# Altium schematic sheet main.SchDoc: =ProjectName+'_'+Revision+'_'+VariantName
size A3; Author: [Sheet Author]; DocumentNumber: 1; Revision: 0; SheetNumber: 1; SheetTotal: 5
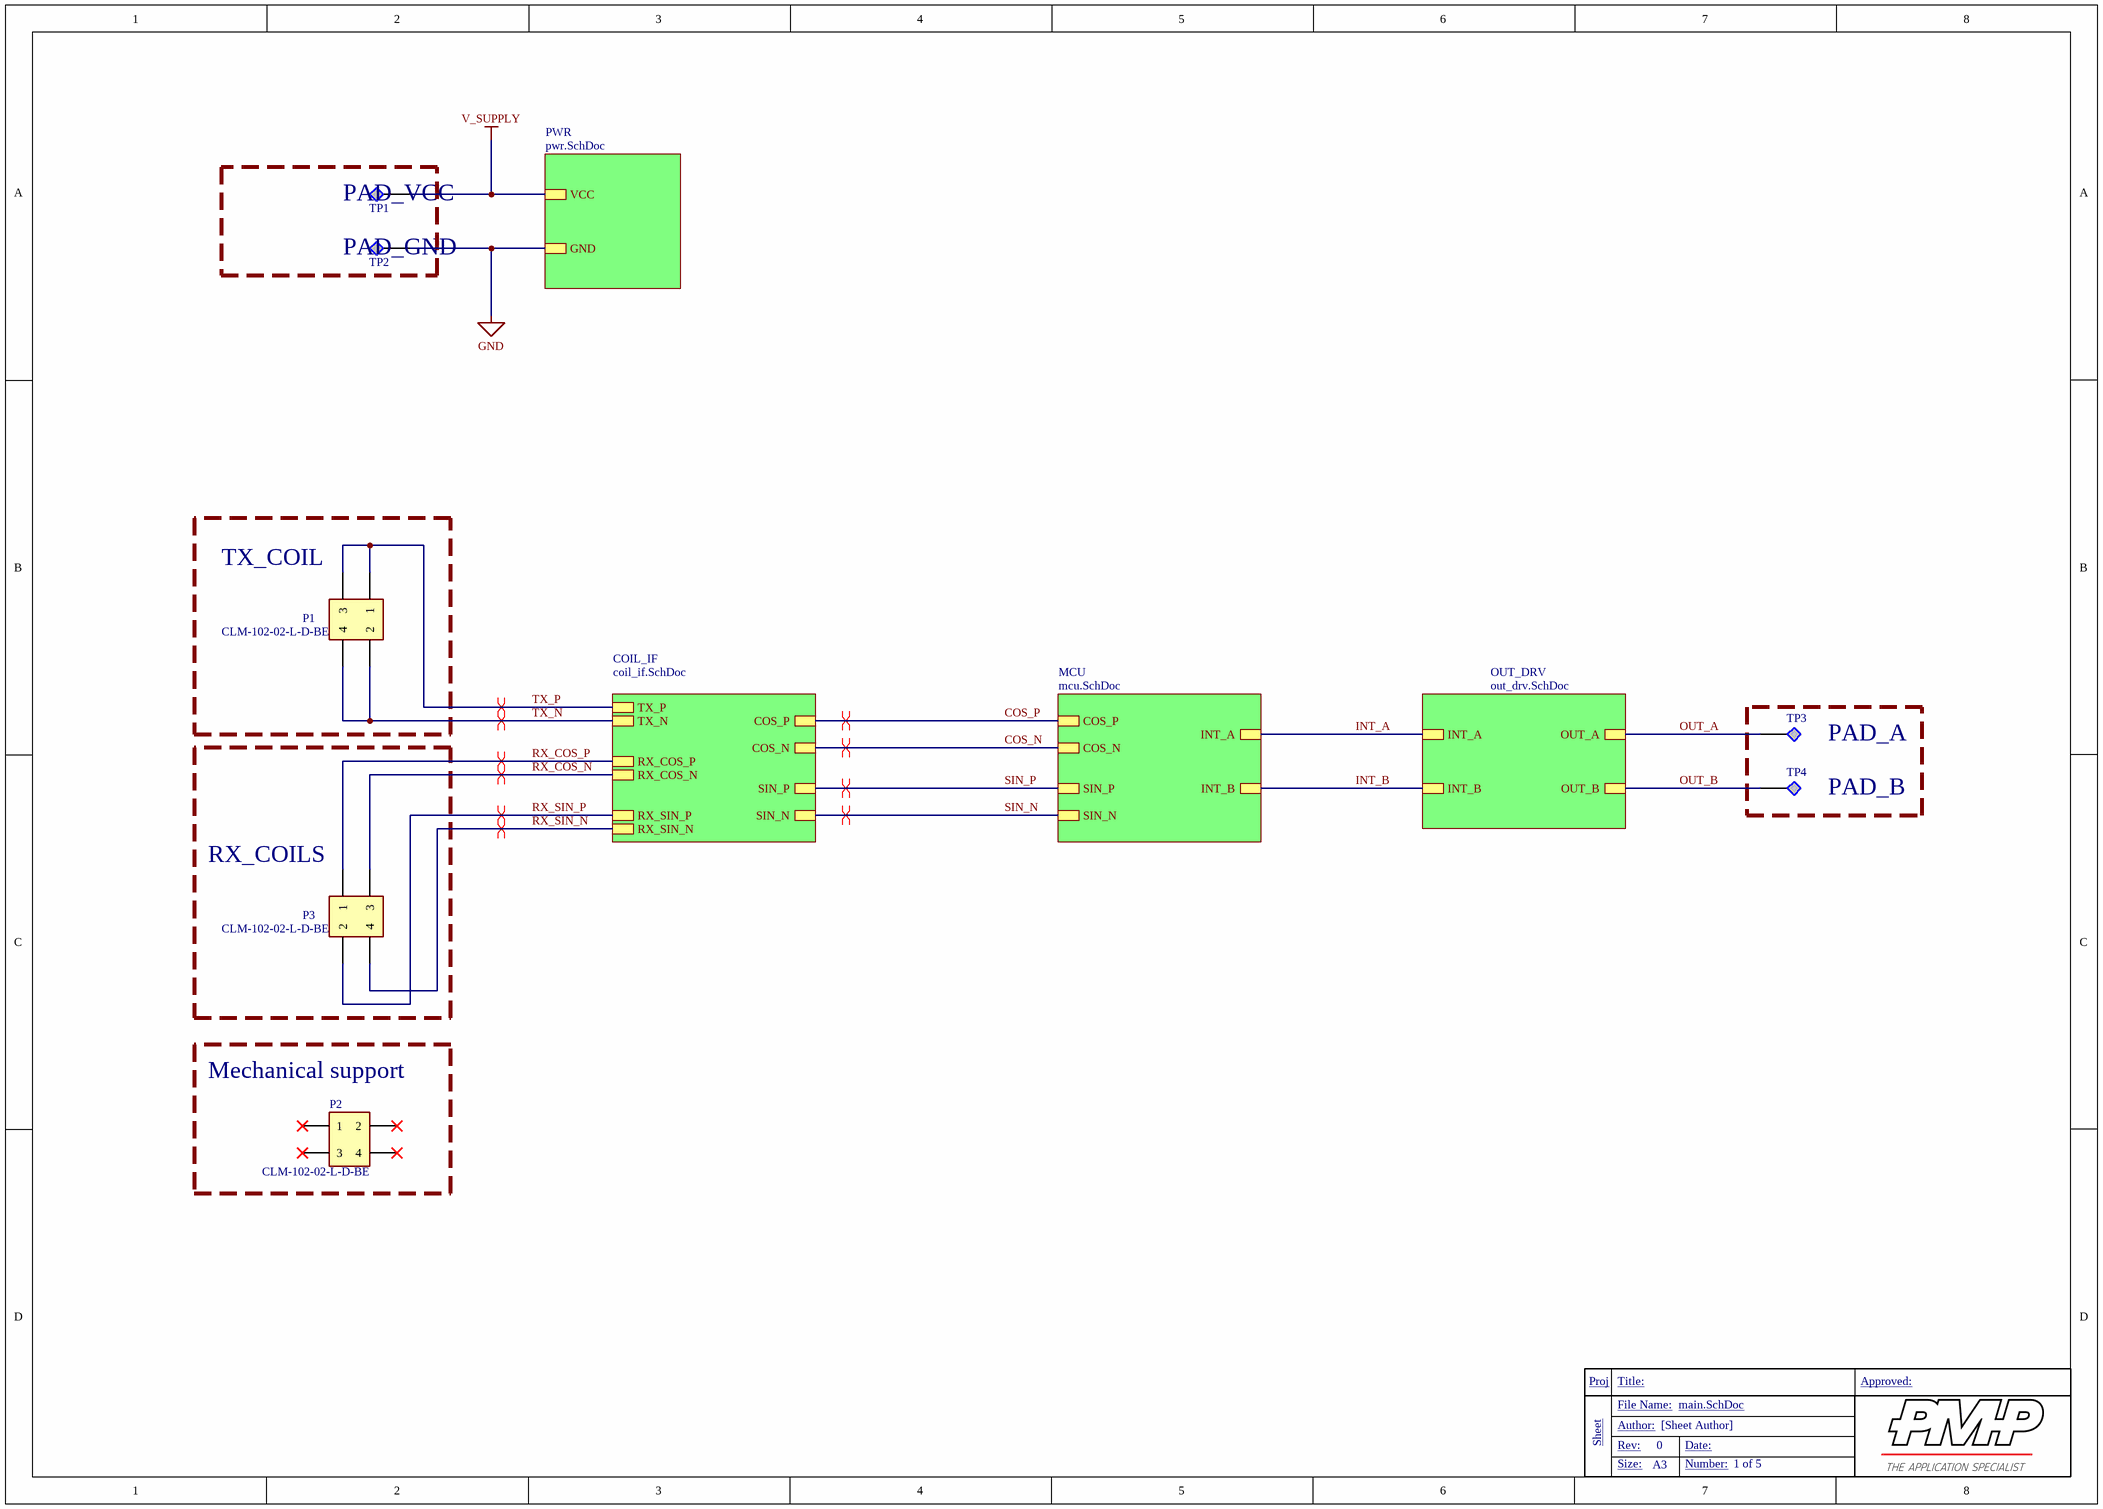
[diagram p0: main.SchDoc]

## Parts
P1  CLM-102-02-L-D-BE  [SAMTEC_CLM-102-02-X-D-BE_SPECIAL]
P2  CLM-102-02-L-D-BE  [SAMTEC_CLM-102-02-X-D-BE_SPECIAL]
P3  CLM-102-02-L-D-BE  [SAMTEC_CLM-102-02-X-D-BE_SPECIAL]
TP1  Term Pole  [Terminale 508-0685_2mm]  (value not drawn)
TP2  Term Pole  [Terminale 508-0685_2mm]  (value not drawn)
TP3  Term Pole  [Terminale 508-0685_2mm]  (value not drawn)
TP4  Term Pole  [Terminale 508-0685_2mm]  (value not drawn)

## Blocks framed on the sheet
TX_COIL: P1
RX_COILS: P3
Mechanical support: P2

## Sub-sheets
COIL_IF = coil_if.SchDoc: COS_P, COS_N, TX_P, TX_N, RX_COS_N, RX_COS_P, SIN_N, SIN_P, RX_SIN_N, RX_SIN_P
MCU = mcu.SchDoc: INT_A, INT_B, COS_P, COS_N, SIN_N, SIN_P
OUT_DRV = out_drv.SchDoc: OUT_A, OUT_B, INT_A, INT_B
PWR = pwr.SchDoc: GND, VCC

## Nets
GND: TP2.1 ; sheet PWR/GND
V_SUPPLY: TP1.1 ; sheet PWR/VCC
COS_N: sheet MCU/COS_N, sheet COIL_IF/COS_N
COS_P: sheet MCU/COS_P, sheet COIL_IF/COS_P
INT_A: sheet OUT_DRV/INT_A, sheet MCU/INT_A
INT_B: sheet OUT_DRV/INT_B, sheet MCU/INT_B
OUT_A: TP3.1 ; sheet OUT_DRV/OUT_A
OUT_B: TP4.1 ; sheet OUT_DRV/OUT_B
RX_COS_N: P3.03(3) ; sheet COIL_IF/RX_COS_N
RX_COS_P: P3.01(1) ; sheet COIL_IF/RX_COS_P
RX_SIN_N: P3.04(4) ; sheet COIL_IF/RX_SIN_N
RX_SIN_P: P3.02(2) ; sheet COIL_IF/RX_SIN_P
SIN_N: sheet MCU/SIN_N, sheet COIL_IF/SIN_N
SIN_P: sheet MCU/SIN_P, sheet COIL_IF/SIN_P
TX_N: P1.02(2) P1.04(4) ; sheet COIL_IF/TX_N
TX_P: P1.01(1) P1.03(3) ; sheet COIL_IF/TX_P

Not connected (* = marked no-connect by the designer): P2 01(1)* 02(2)* 03(3)* 04(4)*

## Layout directives
differential pair: COS_N, COS_P, RX_COS_N, RX_COS_P, RX_SIN_N, RX_SIN_P, SIN_N, SIN_P, TX_N, TX_P

## Notes on the sheet
- PAD_VCC
- PAD_GND
- PAD_A
- PAD_B
- Proj
- Title:
- Approved:
- Sheet
- File Name:
- Rev:
- Author:
- Date:
- Size:
- A3
- Number:

## Library data of the parts
P1-P3 = CLM-102-02-L-D-BE: Samtech Female header 2x2,pitch 1mm; MP: TSW-108-07-G-S; MF: Samtec; ConnType: Board 2 Board; Min Op# Temp °C: -55; Max Op# temp °C: 125; Availability: Unavailable; Package: None; Value: CLM-102-02-L-D-BE; Price: None; MPN1: CLM-102-02-L-D-BE; MFG1: Samtec; Pins: 4; Pitch: 1mm; Orientation: Vertical; Mount: SMD; Supplier: Mouser; Supplier Part Number: 200-CLM10202LDBE; Supplier URL: https://www.mouser.it/it/ProductDetail/Samtec/CLM-102-02-L-D-BE?qs=rU5fayqh%252BE2B%252BzS%2F4mx9aQ%3D%3D; Datasheet URL: https://www.mouser.it/datasheet/3/85/1/clm_sm.pdf
TP1-TP4 = 20-2137: Occhiello PTH, 1mm, Black, Plated; MFG1: Vero Tech Ltd; ConnType: TestProbe; MPN1: 20-2137; Value: Term Pole; Pins: 1; Case/Package: PTH; Orientation: Radial; Mount: TH; Supplier: RS; Supplier Part Number: 101-2391; Supplier URL: https://it.rs-online.com/web/p/morsetti-terminali/1012391?searchId=bf2eecf7-719e-4693-ba83-d06578001651&gb=s; Datasheet URL: https://docs.rs-online.com/56da/0900766b80c120b2.pdf; Color: Black